# Altium schematic sheet SUBBOARD-voltage_sensors.SchDoc
size A3
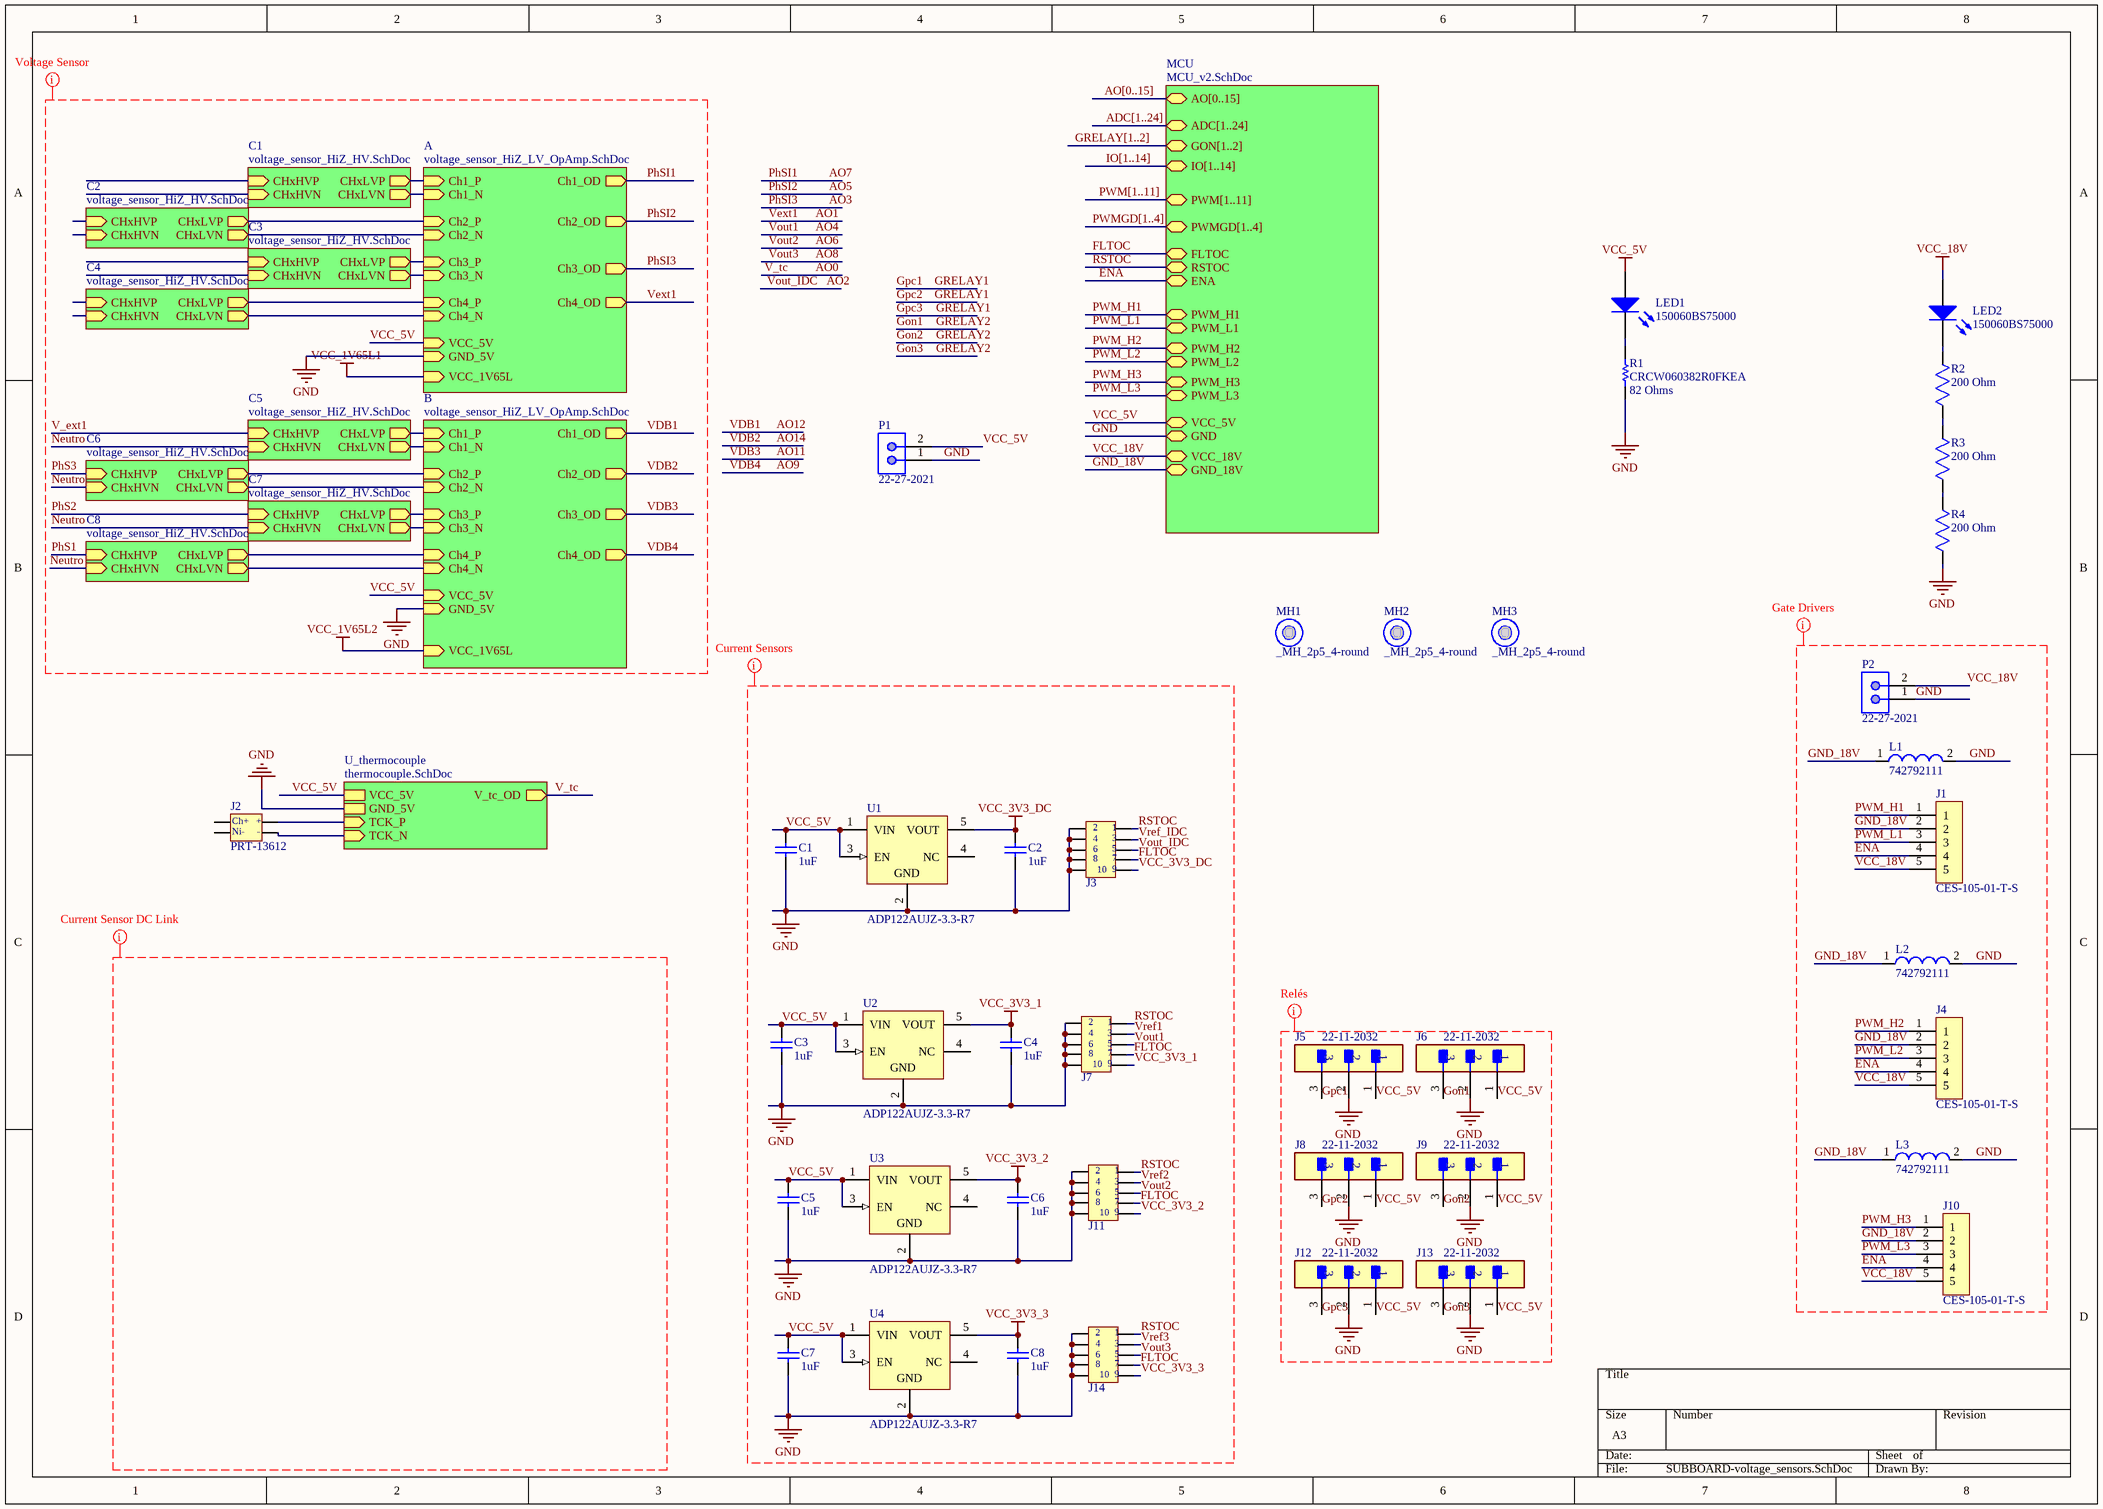
[diagram p0: SUBBOARD-voltage_sensors.SchDoc]

## Parts
C1  value 1uF  [CAPC0603(1608)100_N]  (hidden comment: CAP 1uF 50V 0603(1608))
C2  value 1uF  [CAPC0603(1608)100_N]  (hidden comment: CAP 1uF 50V 0603(1608))
C3  value 1uF  [CAPC0603(1608)100_N]  (hidden comment: CAP 1uF 50V 0603(1608))
C4  value 1uF  [CAPC0603(1608)100_N]  (hidden comment: CAP 1uF 50V 0603(1608))
C5  value 1uF  [CAPC0603(1608)100_N]  (hidden comment: CAP 1uF 50V 0603(1608))
C6  value 1uF  [CAPC0603(1608)100_N]  (hidden comment: CAP 1uF 50V 0603(1608))
C7  value 1uF  [CAPC0603(1608)100_N]  (hidden comment: CAP 1uF 50V 0603(1608))
C8  value 1uF  [CAPC0603(1608)100_N]  (hidden comment: CAP 1uF 50V 0603(1608))
J1  CES-105-01-T-S  [CES-105-01-T-S]
J2  PRT-13612  [PRT-13612]
J3  0878311020  [0878311020]  (value not drawn)
J4  CES-105-01-T-S  [CES-105-01-T-S]
J5  22-11-2032  [FP-22-11-2032-MFG]
J6  22-11-2032  [FP-22-11-2032-MFG]
J7  0878311020  [0878311020]  (value not drawn)
J8  22-11-2032  [FP-22-11-2032-MFG]
J9  22-11-2032  [FP-22-11-2032-MFG]
J10  CES-105-01-T-S  [CES-105-01-T-S]
J11  0878311020  [0878311020]  (value not drawn)
J12  22-11-2032  [FP-22-11-2032-MFG]
J13  22-11-2032  [FP-22-11-2032-MFG]
J14  0878311020  [0878311020]  (value not drawn)
L1  742792111  [SMD-1206]
L2  742792111  [SMD-1206]
L3  742792111  [SMD-1206]
LED1  150060BS75000  [0603_A]
LED2  150060BS75000  [0603_A]
MH1  _MH_2p5_4-round  [_MH_2p5_4-round]
MH2  _MH_2p5_4-round  [_MH_2p5_4-round]
MH3  _MH_2p5_4-round  [_MH_2p5_4-round]
P1  22-27-2021  [MOLX-22-27-2021_V]
P2  22-27-2021  [MOLX-22-27-2021_V]
R1  CRCW060382R0FKEA  value 82 Ohms  [RESC1609X50X30LL10T20]
R2  200 Ohm  [CRCW0603200RFKEAHP]
R3  200 Ohm  [CRCW0603200RFKEAHP]
R4  200 Ohm  [CRCW0603200RFKEAHP]
U1  ADP122AUJZ-3.3-R7  [ADI-UJ-5_N]
U2  ADP122AUJZ-3.3-R7  [ADI-UJ-5_N]
U3  ADP122AUJZ-3.3-R7  [ADI-UJ-5_N]
U4  ADP122AUJZ-3.3-R7  [ADI-UJ-5_N]

## Sub-sheets
A = voltage_sensor_HiZ_LV_OpAmp.SchDoc: VCC_5V (in), GND_5V (in), Ch1_OD (out), Ch2_OD (out), Ch3_OD (out), Ch4_OD (out), Ch1_N (in), Ch1_P (in), Ch2_N (in), Ch2_P (in), Ch3_N (in), Ch3_P (in), Ch4_N (in), Ch4_P (in), VCC_1V65L (in)
B = voltage_sensor_HiZ_LV_OpAmp.SchDoc: VCC_5V (in), GND_5V (in), Ch1_OD (out), Ch2_OD (out), Ch3_OD (out), Ch4_OD (out), Ch1_N (in), Ch1_P (in), Ch2_N (in), Ch2_P (in), Ch3_N (in), Ch3_P (in), Ch4_N (in), Ch4_P (in), VCC_1V65L (in)
C1 = voltage_sensor_HiZ_HV.SchDoc: CHxLVP (out), CHxHVN (in), CHxLVN (out), CHxHVP (in)
C2 = voltage_sensor_HiZ_HV.SchDoc: CHxLVP (out), CHxHVN (in), CHxLVN (out), CHxHVP (in)
C3 = voltage_sensor_HiZ_HV.SchDoc: CHxLVP (out), CHxHVN (in), CHxLVN (out), CHxHVP (in)
C4 = voltage_sensor_HiZ_HV.SchDoc: CHxLVP (out), CHxHVN (in), CHxLVN (out), CHxHVP (in)
C5 = voltage_sensor_HiZ_HV.SchDoc: CHxLVP (out), CHxHVN (in), CHxLVN (out), CHxHVP (in)
C6 = voltage_sensor_HiZ_HV.SchDoc: CHxLVP (out), CHxHVN (in), CHxLVN (out), CHxHVP (in)
C7 = voltage_sensor_HiZ_HV.SchDoc: CHxLVP (out), CHxHVN (in), CHxLVN (out), CHxHVP (in)
C8 = voltage_sensor_HiZ_HV.SchDoc: CHxLVP (out), CHxHVN (in), CHxLVN (out), CHxHVP (in)
MCU = MCU_v2.SchDoc: ADC[1..24] (bidir), IO[1..14] (bidir), PWM[1..11] (bidir), PWMGD[1..4] (bidir), ENA (bidir), PWM_H1 (bidir), PWM_L1 (bidir), PWM_H2 (bidir), PWM_L2 (bidir), PWM_H3 (bidir), PWM_L3 (bidir), VCC_5V (bidir), GND (bidir), VCC_18V (bidir), GND_18V (bidir), RSTOC (bidir), FLTOC (bidir), AO[0..15] (bidir), GON[1..2] (bidir)
U_thermocouple = thermocouple.SchDoc: V_tc_OD (out), VCC_5V, GND_5V, TCK_P (in), TCK_N (in)

## Nets
GND: C1.1 C2.1 C3.1 C4.1 C5.1 C6.1 C7.1 C8.1 J3.2 J3.4 J3.6 J3.8 J3.10 J5.2 J6.2 J7.2 J7.4 J7.6 J7.8 J7.10 J8.2 J9.2 J11.2 J11.4 J11.6 J11.8 J11.10 J12.2 J13.2 J14.2 J14.4 J14.6 J14.8 J14.10 L1.2 L2.2 L3.2 P1.1 P2.1 R1.2 R4.1 U1.2(GND) U2.2(GND) U3.2(GND) U4.2(GND) ; sheet A/GND_5V, sheet B/GND_5V, sheet MCU/GND, sheet U_thermocouple/GND_5V
VCC_1V65L1: sheet A/VCC_1V65L
VCC_1V65L2: sheet B/VCC_1V65L
VCC_3V3_1: C4.2 J7.9 U2.5(VOUT)
VCC_3V3_2: C6.2 J11.9 U3.5(VOUT)
VCC_3V3_3: C8.2 J14.9 U4.5(VOUT)
VCC_3V3_DC: C2.2 J3.9 U1.5(VOUT)
VCC_5V: C1.2 C3.2 C5.2 C7.2 J5.1 J6.1 J8.1 J9.1 J12.1 J13.1 LED1.2(A) P1.2 U1.1(VIN) U1.3(EN) U2.1(VIN) U2.3(EN) U3.1(VIN) U3.3(EN) U4.1(VIN) U4.3(EN) ; sheet A/VCC_5V, sheet B/VCC_5V, sheet MCU/VCC_5V, sheet U_thermocouple/VCC_5V
VCC_18V: J1.5 J4.5 J10.5 LED2.2(A) P2.2 ; sheet MCU/VCC_18V
AO0: sheet U_thermocouple/V_tc_OD  [also labelled V_tc]
AO1: sheet A/Ch4_OD  [also labelled Vext1]
AO2: J3.5  [also labelled Vout_IDC]
AO3: sheet A/Ch3_OD  [also labelled PhSI3]
AO4: J7.5  [also labelled Vout1]
AO5: sheet A/Ch2_OD  [also labelled PhSI2]
AO6: J11.5  [also labelled Vout2]
AO7: sheet A/Ch1_OD  [also labelled PhSI1]
AO8: J14.5  [also labelled Vout3]
AO9: sheet B/Ch4_OD  [also labelled VDB4]
AO11: sheet B/Ch3_OD  [also labelled VDB3]
AO12: sheet B/Ch1_OD  [also labelled VDB1]
AO14: sheet B/Ch2_OD  [also labelled VDB2]
ENA: J1.4 J4.4 J10.4 ; sheet MCU/ENA
FLTOC: J3.7 J7.7 J11.7 J14.7 ; sheet MCU/FLTOC
GND_18V: J1.2 J4.2 J10.2 L1.1 L2.1 L3.1 ; sheet MCU/GND_18V
Gon1: J6.3 J9.3 J13.3  [also labelled Gon2, Gon3, GRELAY2]
Gpc1: J5.3 J8.3 J12.3  [also labelled Gpc2, Gpc3, GRELAY1]
Neutro: sheet C5/CHxHVN, sheet C6/CHxHVN, sheet C7/CHxHVN, sheet C8/CHxHVN
PhS1: sheet C8/CHxHVP
PhS2: sheet C7/CHxHVP
PhS3: sheet C6/CHxHVP
PWM_H1: J1.1 ; sheet MCU/PWM_H1
PWM_H2: J4.1 ; sheet MCU/PWM_H2
PWM_H3: J10.1 ; sheet MCU/PWM_H3
PWM_L1: J1.3 ; sheet MCU/PWM_L1
PWM_L2: J4.3 ; sheet MCU/PWM_L2
PWM_L3: J10.3 ; sheet MCU/PWM_L3
RSTOC: J3.1 J7.1 J11.1 J14.1 ; sheet MCU/RSTOC
V_ext1: sheet C5/CHxHVP
Vref1: J7.3
Vref2: J11.3
Vref3: J14.3
Vref_IDC: J3.3
NetJ2_3: J2.3 ; sheet U_thermocouple/TCK_P
NetJ2_4: J2.4 ; sheet U_thermocouple/TCK_N
NetLED1_1: LED1.1(K) R1.1
NetLED2_1: LED2.1(K) R2.2
NetR2_1: R2.1 R3.2
NetR3_1: R3.1 R4.2
(unnamed): sheet A/Ch1_N, sheet C1/CHxLVN
(unnamed): sheet A/Ch1_P, sheet C1/CHxLVP
(unnamed): sheet A/Ch2_N, sheet C2/CHxLVN
(unnamed): sheet A/Ch2_P, sheet C2/CHxLVP
(unnamed): sheet A/Ch3_N, sheet C3/CHxLVN
(unnamed): sheet A/Ch3_P, sheet C3/CHxLVP
(unnamed): sheet A/Ch4_N, sheet C4/CHxLVN
(unnamed): sheet A/Ch4_P, sheet C4/CHxLVP
(unnamed): sheet C5/CHxLVP, sheet B/Ch1_P
(unnamed): sheet C5/CHxLVN, sheet B/Ch1_N
(unnamed): sheet C6/CHxLVP, sheet B/Ch2_P
(unnamed): sheet C6/CHxLVN, sheet B/Ch2_N
(unnamed): sheet C7/CHxLVP, sheet B/Ch3_P
(unnamed): sheet C7/CHxLVN, sheet B/Ch3_N
(unnamed): sheet C8/CHxLVP, sheet B/Ch4_P
(unnamed): sheet C8/CHxLVN, sheet B/Ch4_N

Not connected (* = marked no-connect by the designer): J2 1 2; U1 4(NC); U2 4(NC); U3 4(NC); U4 4(NC)

## Buses and harness runs
bus ADC[1..24] = sheet MCU/ADC[1..24]
bus AO[0..15] = sheet MCU/AO[0..15]
bus GRELAY[1..2] = sheet MCU/GON[1..2]
bus IO[1..14] = sheet MCU/IO[1..14]
bus PWM[1..11] = sheet MCU/PWM[1..11]
bus PWMGD[1..4] = sheet MCU/PWMGD[1..4]

## Layout directives
mark named Current Sensors: FLTOC, GND, RSTOC, VCC_3V3_1, VCC_3V3_2, VCC_3V3_3, VCC_3V3_DC, VCC_5V, Vout1, Vout2, Vout3, Vout_IDC, Vref1, Vref2, Vref3, Vref_IDC
mark named Relés: GND, Gon1, Gon2, Gon3, Gpc1, Gpc2, Gpc3, VCC_5V
mark named Current Sensor DC Link: (no net found under the mark)
mark named Voltage Sensor: GND, Neutro, PhS1, PhS2, PhS3, PhSI1, PhSI2, PhSI3, V_ext1, VCC_1V65L1, VCC_1V65L2, VCC_5V, VDB1, VDB2, VDB3, VDB4, Vext1
mark named Gate Drivers: ENA, GND, GND_18V, PWM_H1, PWM_H2, PWM_H3, PWM_L1, PWM_L2, PWM_L3, VCC_18V

## Notes on the sheet
- (in symbol PRT-13612) Ch+; +; Ni-; -

## Library data of the parts
C1-C8 = CMP-1035-02746-1: CAP 1uF 50V ±20% 0603 (1608 Metric) Thickness 1mm SMD; Tolerance: Â±20%; Case-EIA: 0603; Case-Metric: 1608; Technology: SMT; Max Thickness: 1 mm; Rated Voltage: 50 V
J1 J4 J10 = CES-105-01-T-S: SAMTEC         CES-105-01-T-S             Board-To-Board Connector, CES Series, 5 Contacts, Receptacle, 2.54 mm, Through Hole, 1 Rows; Number of Contacts: 5; Contact Resistance: 10mR; Max Current Rating: 1A; Max Voltage Rating (AC): 400V; Pitch: 2.54mm; Manufacturer: Samtec; Manufacturer Part Number: CES-105-01-T-S; RoHS: Yes; Category: Connectors; Stock 1: 235; Pricing 1: 1=0,57000, 10=0,53600, 25=0,48280, 50=0,42920, 100=0,41120, 250=0,37548, 500=0,35760 (USD); Mount: Through Hole; Contact Plating: Tin; Housing Color: Black; Contact Material: Bronze; Color: Black; Housing Material: Polyester; Min Operating Temperature: -55°C; Max Operating Temperature: 105°C; Number of Rows: 1; Termination: Solder; Orientation: Straight; Packaging: Bulk; Package Quantity: 1; Connector Type: Receptacle; Number of Positions: 5; Gender: Receptacle; Length: 12.7mm; Depth: 3.05mm; Width: 3.05mm; Radiation Hardening: No; Lead Free: Lead Free; REACH SVHC: No SVHC; ComponentLink1URL: https://datasheet.ciiva.com/413/ces-mkt-413356.pdf?src-supplier=Digi-Key; ComponentLink1Description: https://datasheet.ciiva.com/413/ces-mkt-413356.pdf?src-supplier=Digi-Key; Supplier 1: Digi-Key; Supplier 2: Arrow; Supplier 3: Mouser; Supplier 4: Newark; Supplier Part Number 2: CES-105-01-T-S; Supplier Part Number 3: 200-CES10501TS; Supplier Part Number 4: 11P3506; Supplier Part Number 1: SAM1087-05-ND
J2 = PRT-13612: THERMOCOUPLE CONN - PCC-SMP-K; Manufacturer: SparkFun; System: Connector; Supplier 1: Digi-Key; Manufacturer Part Number: PRT-13612; RoHS: No; Stock 1: 201; Pricing 1: 1=4.38000 (USD); ComponentLink1URL: https://cdn.sparkfun.com/datasheets/Prototyping/PCC-SMP-K-datasheet.pdf?src-supplier=Digi-Key; ComponentLink1Description: https://cdn.sparkfun.com/datasheets/Prototyping/PCC-SMP-K-datasheet.pdf?src-supplier=Digi-Key; Supplier Part Number 1: 1568-1306-ND
J3 J7 J11 J14 = 0878311020: Conn Shrouded Header HDR 10 POS 2mm Solder ST Thru-Hole Milli-Grid™ Tube; Manufacturer: Molex; Number of Positions: 10; Connector Type: Male Pin; Row Spacing: 0.079inch; Supplier 1: Digi-Key; Manufacturer Part Number: 0878311020; RoHS: Yes; Category: Headers and Wire Housings; Stock 1: 7937; Pricing 1: 1=1.65000, 10=1.50100, 100=1.28650, 500=1.07206, 1000=0.91890, 5000=0.81476, 10000=0.79638 (USD); Mount: Through Hole; Contact Plating: Gold; Contact Material: Bronze; Color: Black; Housing Material: Nylon; Housing Color: Black; Min Operating Temperature: -55°C; Max Operating Temperature: 105°C; Termination: Solder; Number of Contacts: 10; Number of Rows: 2; Packaging: Rail/Tube; Orientation: Straight; Length: 12.65mm; Pitch: 2mm; Contact Mating Length: 0.141inch; Depth: 6.3mm; Radiation Hardening: No; ComponentLink1URL: https://datasheet.ciiva.com/6814/878311620-sd-6814006.pdf?src-supplier=Digi-Key; ComponentLink1Description: https://datasheet.ciiva.com/6814/878311620-sd-6814006.pdf?src-supplier=Digi-Key; Supplier Part Number 1: WM18560-ND
J5 J6 J8 J9 J12 J13 = CMP-04776-000113-1: CONN HEADER VERT 3POS 2.54MM; Manufacturer: Molex; Number Of Contacts: 3; Voltage Rating: 500V; Conn Gender: Male; Current Rating: 4A; Conn Orientation: Vertical; Device Class L2: Headers and Wire Housings; Number Of Rows: 1; Temperature Range High: +80°C; RoHS: TRUE; ComponentLink2URL: https://www.molex.com/webdocs/datasheets/pdf/en-us/0022112032_PCB_HEADERS.pdf; Manufacturer Part Number: 22-11-2032; Device Class L3: unset; Automotive: No; Temperature: -40°C to +80°C; Temperature Range Low: -40°C; Lead Free: Yes; Pitch: 2.54mm; Footprint Url: https://www.molex.com/pdm_docs/sd/022112032_sd.pdf; Digikey Description: CONN HEADER VERT 3POS 2.54MM; Contact Material: Gold,Nickel; Octopart: https://octopart.com/22-11-2032-molex-10085; Height: 10.91mm; Mouser Description: KK® 254 Solid Header, Vertical, with Friction Lock, 3 Circuits, Gold (Au) Plating; Package: 22-11-2032; Device Class L1: Connectors; Mounting Type: Through Hole; ComponentLink2Description: Datasheet; Category: Conn
L1-L3 = CMP-0220-00024-1: SMD EMI Suppression Ferrite Bead WE-CBF, Z = 26 Ohm; Impedance: 26 Ohm; ComponentLink2Description: Datasheet; PackageReference: SMD-1206; ComponentLink2URL: http://www.we-online.de/katalog/media/pdf/742792111.pdf; PackageVersion: 2007; DatasheetVersion: Dec-2005; PackageDescription: Chip Inductor, 2-Leads, Body 3.2 x 1.6 mm; ComponentLink1URL: http://www.we-online.com; ComponentLink1Description: Manufacturer Link
LED1 LED2 = CMP-1426-00003-1: SMD mono-color Chip LED, WL-SMCW, Blue; Manufacturer: Wuerth Elektronik; Color: Blue; ComponentLink2Description: Datasheet; ComponentLink2URL: http://katalog.we-online.com/led/datasheet/150060BS75000.pdf; ComponentLink1URL: http://www.we-online.com; PackageReference: 0603_A; PartNumber: 150060BS75000; ComponentLink1Description: Manufacturer URL
MH1-MH3 = _MH_2p5_4-round: matching hole 2.5 hole, 4mm pad (round)
P1 P2 = CMP-2000-05537-1: Male Header, Pitch 2.54 mm, 1 x 2 Position, Height 11.7 mm, Tail Length 3.56 mm, 0 to 75 degC, RoHS, Bulk; Manufacturer: Molex; PartNumber: 0022272021; Current rating: 4A; Package Version: Rev. BC, 02/2012; Voltage rating: 250V; No. of Positions: 2; Pitch: 2.54mm; No. of Rows: 1; Orientation: Vertical; Operating temperature: 0°Cto+75°C; Manufacturer URL: http://www.molex.com/; Mounting Technology: ThroughHole; Housing material: Nylon(UL94V-0); Package Description: 2-Leads Header, Body 5.08 x 5.8 mm, Pitch 2.54 mm; Voltage - Max: 250V; Datasheet URL: http://www.molex.com/pdm_docs/sd/022272021_sd.pdf; Package Reference: 22-27-2021; Contact material: Tinplatedbrass; Current - Max: 4A; Datasheet Version: Rev. F, 06/2009
R1 = CMP-2000-03606-1: Manufacturer: Vishay Dale; Part Number: CRCW060382R0FKEA
R2-R4 = CRCW0603200RFKEAHP: CRCW0603200RFKEAHP / Res Thick Film 0603 200 Ohm 1% 0.25W(1/4W) ±100ppm/C Pad SMD Automotive T/R; Manufacturer: Vishay Dale; Resistance: 200R; Power Rating: 250mW; Temperature Coefficient: 100ppm/°C; Supplier 1: Digi-Key; Manufacturer Part Number: CRCW0603200RFKEAHP; RoHS: Yes; Category: Chip SMD Resistors; Stock 1: 59007; Pricing 1: 1=0.15000, 10=0.12900, 100=0.05030, 1000=0.02106, 2500=0.01930 (USD); Mount: Surface Mount; Case/Package: 0603; Case Code (Imperial): 0603; Case Code (Metric): 1608; Contact Plating: Tin; Min Operating Temperature: -55°C; Max Operating Temperature: 155°C; Features: Automotive AEC-Q200; Tolerance: 1%; Packaging: Tape and Reel; Resistor Type: Thick Film; Max Power Dissipation: 250mW; Number of Terminations: 2; Package Quantity: 5000; Length: 0.063inch; Width: 0.033inch; Height: 0.022inch; Radiation Hardening: No; Lead Free: Lead Free; ComponentLink1URL: https://datasheet.ciiva.com/2578/crcwhpe3-2578537.pdf?src-supplier=Digi-Key; ComponentLink1Description: https://datasheet.ciiva.com/2578/crcwhpe3-2578537.pdf?src-supplier=Digi-Key; ComponentLink2URL: https://datasheet.ciiva.com/8961/crcwhpe3-8961129.pdf?src-supplier=Avnet; ComponentLink2Description: https://datasheet.ciiva.com/8961/crcwhpe3-8961129.pdf?src-supplier=Avnet; Supplier Part Number 1: 541-200SCT-ND
U1-U4 = CMP-0786-00346-1: 300 mA, Low Quiescent Current, CMOS Linear Regulator, 2.3 to 5.5 V Vin, 3.3 V Vout, Industrial, 5-pin SOT23 (UJ-5), Reel; Manufacturer: Analog Devices; Vin (min) (V): 2.3; Supply Current IGND @ Small Load: 45uA; Vin (max) (V): 5.5; Iout max: 300mA; Preset Vout Values (V): 3.3; ComponentLink4Description: URL Link1; ComponentLink4URL: Product URL:http://www.analog.com/en/ADP122/productSearch.html; ComponentLink2URL: http://www.analog.com/static/imported-files/data_sheets/ADP122_123.pdf; PackageDescription: 5-Pin Thin Small Outline Transistor Package, Body 2.9 x 1.6 mm, Pitch 0.95 mm; ComponentLink1URL: http://www.analog.com/en/index.html; ComponentLink3URL: http:/www.analog.com/static/imported-files/packages/PKG_PDF/TSOT(UJ)/UJ_5.pdf; ComponentLink2Description: Datasheet; PartNumber: ADP122AUJZ-3.3-R7; Packing: Reel; ComponentLink1Description: Manufacturer URL; Code_JEDEC: MO-193-AB; PackageVersion: 100708-A, 10/2008; PackageReference: UJ-5; Mounting Technology: Surface Mount; DatasheetVersion: Rev. E; ComponentLink3Description: Package Specification